# Altium schematic sheet SAST_PCB_V2B_Test_Beta_Sensors_2.SchDoc
size A4; SheetNumber: 1; SheetTotal: 1
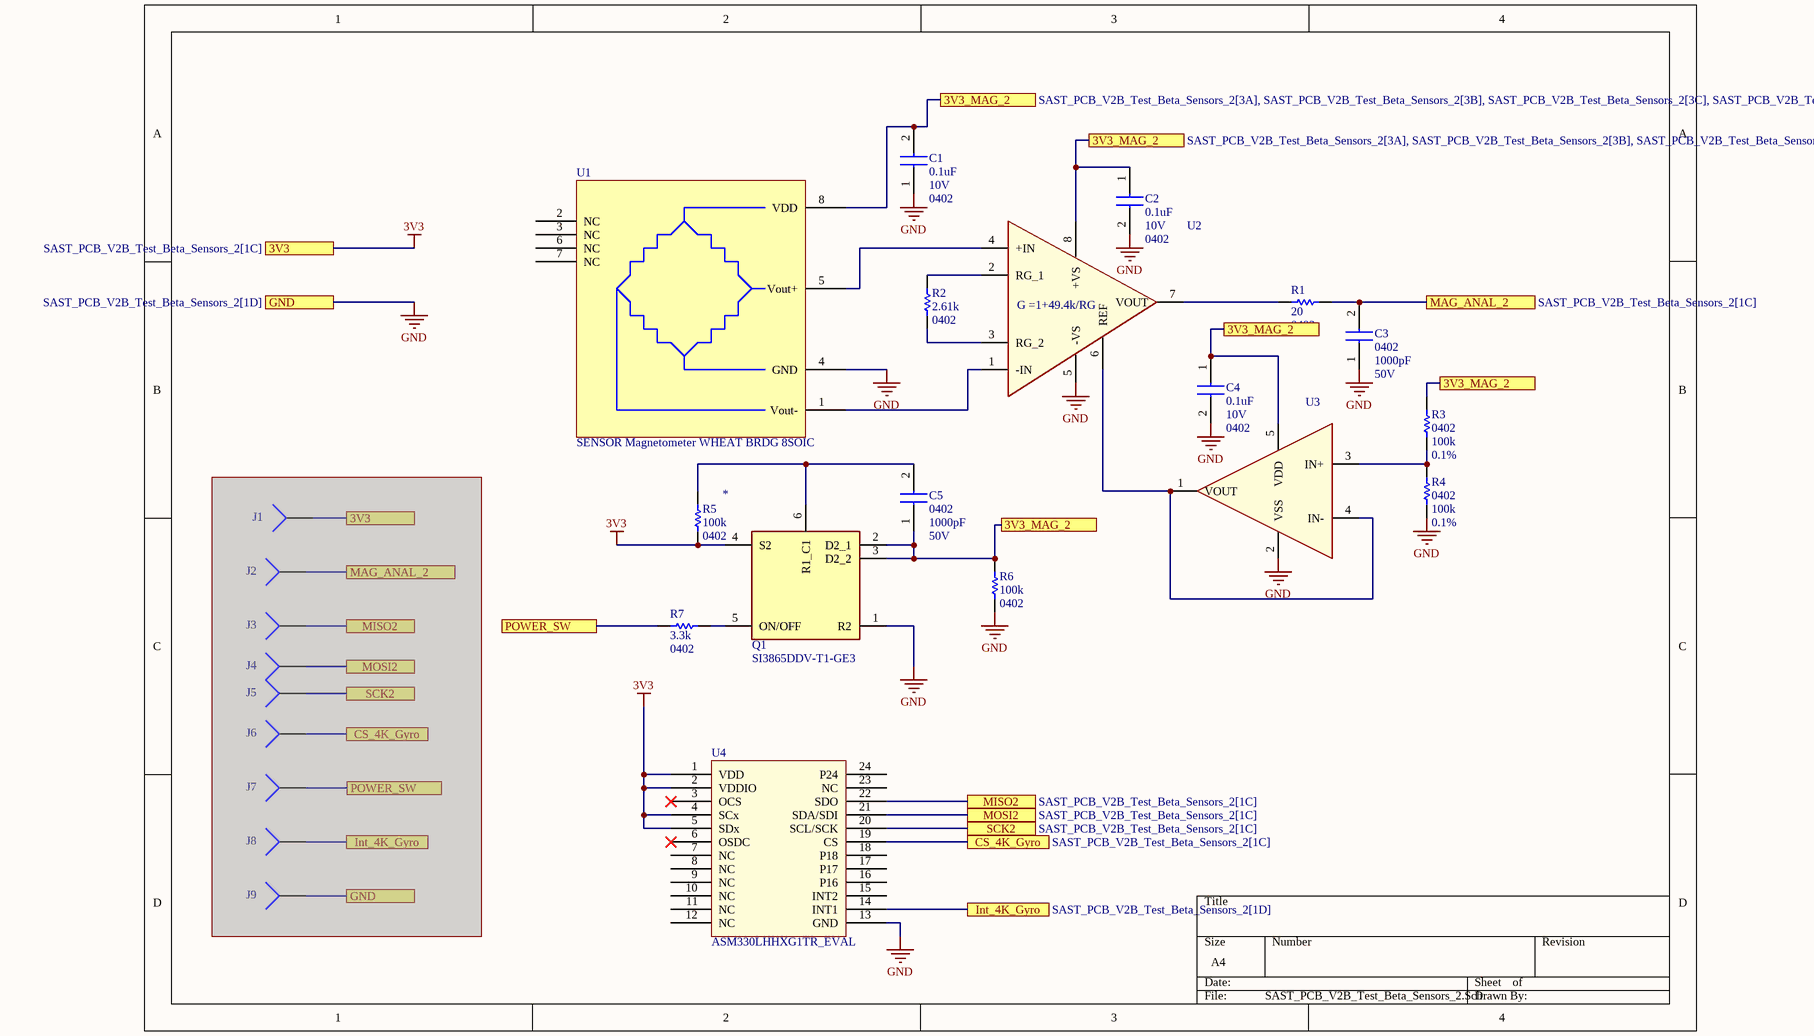
[diagram p0: SAST_PCB_V2B_Test_Beta_Sensors_2.SchDoc]

## Parts
C1  value 0.1uF  Voltage: 10V  Case/Package: 0402  [0402_DSP]  (hidden comment: CAP CER .1UF 10V X8M 0201)
C2  value 0.1uF  Voltage: 10V  Case/Package: 0402  [0402_DSP]  (hidden comment: CAP CER .1UF 10V X8M 0201)
C3  value 1000pF  Case/Package: 0402  Voltage: 50V  [0402_DSP]  (hidden comment: CAP CER 1000PF 50V X8L 0402)
C4  value 0.1uF  Voltage: 10V  Case/Package: 0402  [0402_DSP]  (hidden comment: CAP CER .1UF 10V X8M 0201)
C5  value 1000pF  Case/Package: 0402  Voltage: 50V  [0402_DSP]  (hidden comment: CAP CER 1000PF 50V X8L 0402)
J1  (no value)  [Wire24Awg2x1HPAD]
J2  (no value)  [Wire24Awg2x1HPAD]
J3  (no value)  [Wire24Awg2x1HPAD]
J4  (no value)  [Wire24Awg2x1HPAD]
J5  (no value)  [Wire24Awg2x1HPAD]
J6  (no value)  [Wire24Awg2x1HPAD]
J7  (no value)  [Wire24Awg2x1HPAD]
J8  (no value)  [Wire24Awg2x1HPAD]
J9  (no value)  [Wire24Awg2x1HPAD]
Q1  SI3865DDV-T1-GE3  [SOP95P284X110-6N]
R1  value 20  Case/Package: 0402  [0402_DSP]
R2  value 2.61k  Case/Package: 0402  [0402_DSP]
R3  0402  value 100k  Tolerance: 0.1%  [0402_DSP]
R4  0402  value 100k  Tolerance: 0.1%  [0402_DSP]
R5  value 100k  Case/Package: 0402  [0402_DSP]
R6  value 100k  Case/Package: 0402  [0402_DSP]
R7  value 3.3k  Case/Package: 0402  [0402_DSP]
U1  SENSOR Magnetometer WHEAT BRDG 8SOIC  [SOIC127P600X175-8N]
U2  IC INST AMP 1 CIRCUIT 8MSOP  [SOP65P490X110-8N]  (value not drawn)
U3  IC OPAMP GP 1 CIRCUIT SOT23-5  [SOT95P270X145-5N]  (value not drawn)
U4  ASM330LHHXG1TR_EVAL  [ASM330LHHX_Eval]

## Ports
3V3 (see SAST_PCB_V2B_Test_Beta_Sensors_2[1A]), 3V3 (see SAST_PCB_V2B_Test_Beta_Sensors_2[1C]), 3V3_MAG_2 (see SAST_PCB_V2B_Test_Beta_Sensors_2[3A], SAST_PCB_V2B_Test_Beta_Sensors_2[3B], SAST_PCB_V2B_Test_Beta_Sensors_2[3C]), 3V3_MAG_2 (see SAST_PCB_V2B_Test_Beta_Sensors_2[3A], SAST_PCB_V2B_Test_Beta_Sensors_2[3B], SAST_PCB_V2B_Test_Beta_Sensors_2[3C], SAST_PCB_V2B_Test_Beta_Sensors_2[4B]), 3V3_MAG_2 (see SAST_PCB_V2B_Test_Beta_Sensors_2[3A], SAST_PCB_V2B_Test_Beta_Sensors_2[3B], SAST_PCB_V2B_Test_Beta_Sensors_2[4B]), 3V3_MAG_2 (see SAST_PCB_V2B_Test_Beta_Sensors_2[3A], SAST_PCB_V2B_Test_Beta_Sensors_2[3C], SAST_PCB_V2B_Test_Beta_Sensors_2[4B]), CS_4K_Gyro (see SAST_PCB_V2B_Test_Beta_Sensors_2[1C]), CS_4K_Gyro (see SAST_PCB_V2B_Test_Beta_Sensors_2[3D]), GND (see SAST_PCB_V2B_Test_Beta_Sensors_2[1B]), GND (see SAST_PCB_V2B_Test_Beta_Sensors_2[1D]), Int_4K_Gyro (see SAST_PCB_V2B_Test_Beta_Sensors_2[1D]), Int_4K_Gyro (see SAST_PCB_V2B_Test_Beta_Sensors_2[3D]), MAG_ANAL_2 (see SAST_PCB_V2B_Test_Beta_Sensors_2[1C]), MAG_ANAL_2 (see SAST_PCB_V2B_Test_Beta_Sensors_2[4B]), MISO2 (see SAST_PCB_V2B_Test_Beta_Sensors_2[1C]), MISO2 (see SAST_PCB_V2B_Test_Beta_Sensors_2[3D]), MOSI2 (see SAST_PCB_V2B_Test_Beta_Sensors_2[1C]), MOSI2 (see SAST_PCB_V2B_Test_Beta_Sensors_2[3D]), POWER_SW (see SAST_PCB_V2B_Test_Beta_Sensors_2[1C]), POWER_SW (see SAST_PCB_V2B_Test_Beta_Sensors_2[1D]), SCK2 (see SAST_PCB_V2B_Test_Beta_Sensors_2[1C]), SCK2 (see SAST_PCB_V2B_Test_Beta_Sensors_2[3D])

## Nets
3V3: J1.1 Q1.4(S2) R5.1 U4.1(VDD) U4.2(VDDIO) U4.4(SCx) U4.5(SDx) ; port 3V3
GND: C1.1 C2.2 C3.1 C4.2 J9.1 Q1.1(R2) R4.2 R6.1 U1.4(GND) U2.5(-VS) U3.2(VSS) U4.13(GND) ; port GND
3V3_MAG_2: C1.2 C2.1 C4.1 C5.1 Q1.2(D2_1) Q1.3(D2_2) R3.1 R6.2 U1.8(VDD) U2.8(+VS) U3.5(VDD) ; port 3V3_MAG_2
CS_4K_Gyro: J6.1 U4.19(CS) ; port CS_4K_Gyro
Int_4K_Gyro: J8.1 U4.14(INT1) ; port Int_4K_Gyro
MAG_ANAL_2: C3.2 J2.1 R1.1 ; port MAG_ANAL_2
MISO2: J3.1 U4.22(SDO) ; port MISO2
MOSI2: J4.1 U4.21(SDA/SDI) ; port MOSI2
POWER_SW: J7.1 R7.2 ; port POWER_SW
SCK2: J5.1 U4.20(SCL/SCK) ; port SCK2
NetC5_2: C5.2 Q1.6(R1_C1) R5.2
NetQ1_5: Q1.5(ON/OFF) R7.1
NetR1_2: R1.2 U2.7(VOUT)
NetR2_1: R2.1 U2.3(RG_2)
NetR2_2: R2.2 U2.2(RG_1)
NetR3_2: R3.2 R4.1 U3.3(IN+)
NetU1_1: U1.1(Vout-) U2.1(-IN)
NetU1_5: U1.5(Vout+) U2.4(+IN)
NetU2_6: U2.6(REF) U3.1(VOUT) U3.4(IN-)

Not connected (* = marked no-connect by the designer): U1 2(NC) 3(NC) 6(NC) 7(NC); U4 3(OCS)* 6(OSDC)* 7(NC) 8(NC) 9(NC) 10(NC) 11(NC) 12(NC) 15(INT2) 16(P16) 17(P17) 18(P18) 23(NC) 24(P24)

## Notes on the sheet
- (in symbol AD8226BRMZ-R7) G =1+49.4k/RG

## Library data of the parts
C1 C2 C4 = GCM033M8ED104KE07J: Capacitor: 0.1 µF ±10% 10V Ceramic Capacitor X8M 0201; Manufacturer_Name: Murata Electronics; Datasheet Link: https://search.murata.co.jp/Ceramy/image/img/A01X/G101/ENG/GCM033M8ED104KE07-01A.pdf; Height: 0.33mm; Manufacturer_Part_Number: GCM033M8ED104KE07J; Mouser Part Number: 81-GCM033M8ED104KE07; Mouser Price/Stock: https://www.mouser.co.uk/ProductDetail/Murata-Electronics/GCM033M8ED104KE07J?qs=xZFQr2mActesc5d29hjXRw%3D%3D
C3 C5 = GCM155L81H102KA37D: Capacitor: 1000 pF ±10% 50V Ceramic Capacitor X8L 0402 (1005 Metric); Manufacturer_Name: Murata Electronics; Datasheet Link: https://componentsearchengine.com/Datasheets/2/GCM155L81H102KA37D.pdf; Height: 0.55mm; Manufacturer_Part_Number: GCM155L81H102KA37D; Mouser Part Number: 81-GCM155L81H102KA7D; Mouser Price/Stock: https://www.mouser.co.uk/ProductDetail/Murata-Electronics/GCM155L81H102KA37D?qs=ui%252B2d9lVEI6nM018NUOqBg%3D%3D; Arrow Part Number: GCM155L81H102KA37D; Arrow Price/Stock: https://www.arrow.com/en/products/gcm155l81h102ka37d/murata-manufacturing?region=nac
J1-J9 = Socket: LatestRevisionDate: 17-Jul-2002; LatestRevisionNote: Re-released for DXP Platform.; Publisher: Altium Limited
Q1 = SI3865DDV-T1-GE3: Transistor; Manufacturer_Name: Vishay; Datasheet Link: https://componentsearchengine.com/Datasheets/2/SI3865DDV-T1-GE3.pdf; Height: 1.1mm; Manufacturer_Part_Number: SI3865DDV-T1-GE3; Mouser Part Number: 78-SI3865DDV-T1-GE3; Mouser Price/Stock: https://www.mouser.co.uk/ProductDetail/Vishay-Semiconductors/SI3865DDV-T1-GE3?qs=vuqggo%252BeDiBbC6kpjqT%2F2w%3D%3D; Arrow Part Number: SI3865DDV-T1-GE3; Arrow Price/Stock: https://www.arrow.com/en/products/si3865ddv-t1-ge3/vishay; Case/Package: *
R1 R3 R4 = Resistor 0402: Manufacturer_Name: Vishay / Dale; Supplier_Name: Mouser; Voltage: *
R2 = Resistor 0402: Manufacturer_Name: *; Manufacturer_Part_Number: *; Supplier_Name: *; Supplier_Part_Number: *; Voltage: *
R5-R7 = Resistor 0402: Manufacturer_Name: Vishay / Dale; Manufacturer_Part_Number: CRCW0402100KFKEDC; Supplier_Name: Mouser; Supplier_Part_Number: 71-CRCW0402100KFKEDC; Voltage: *
U1 = AAH002-02E: Integrated Circuit: Magnetoresistive Sensor Single Axis 8-SOIC; Manufacturer_Part_Name: NVE Corp/Sensor Products; Manufacturer_Part_Number: AAH002-02E; Supplier: Digikey; Supplier_Part_Number: 391-1046-5-ND
U2 = AD8226BRMZ-R7: Integrated Circuit: Instrumentation Amplifier 1 Circuit Rail-to-Rail 8-MSOP; Manufacturer_Name: Analog Devices; Datasheet Link: https://componentsearchengine.com/Datasheets/1/AD8226BRMZ-R7.pdf; Height: 1.1mm; Manufacturer_Part_Number: AD8226BRMZ-R7; Mouser Part Number: 584-AD8226BRMZ-R7; Mouser Price/Stock: https://www.mouser.co.uk/ProductDetail/Analog-Devices/AD8226BRMZ-R7?qs=%2FtpEQrCGXCy0K1MIqqlxxw%3D%3D; Arrow Part Number: AD8226BRMZ-R7; Arrow Price/Stock: https://www.arrow.com/en/products/ad8226brmz-r7/analog-devices?region=nac
U3 = MCP6401T-E_OT: Integrated Circuit: General Purpose Amplifier 1 Circuit Rail-to-Rail SOT-23-5; Manufacturer_Name: Microchip; Manufacturer_Part_Number: MCP6401T-E/OT; Datasheet Link: https://componentsearchengine.com/Datasheets/2/MCP6401T-E_OT.pdf; Height: 1.45mm; Mouser Part Number: 579-MCP6401T-E/OT; Mouser Price/Stock: https://www.mouser.co.uk/ProductDetail/Microchip-Technology-Atmel/MCP6401T-E-OT?qs=bxUt0k7cytKn2ZddhA6TyA%3D%3D; Arrow Part Number: MCP6401T-E/OT; Arrow Price/Stock: https://www.arrow.com/en/products/mcp6401t-eot/microchip-technology?region=nac